# Altium project dory-x.PrjPcb (part 10 of 12)
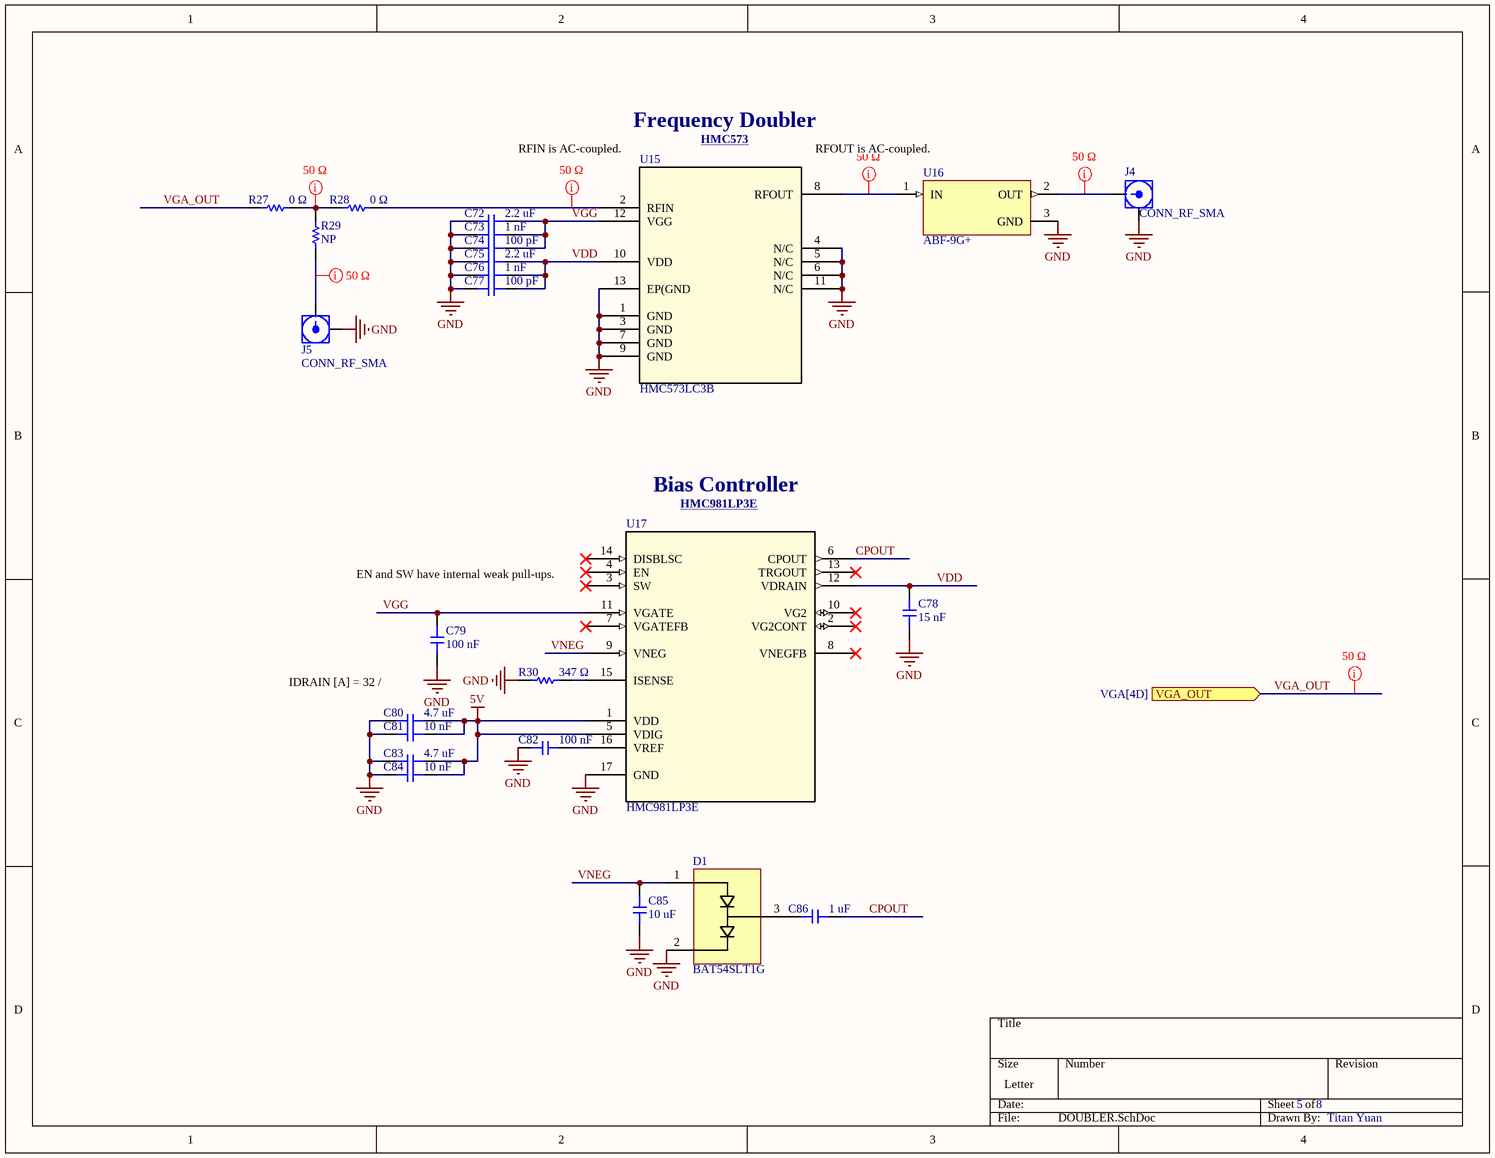
[diagram p16: DOUBLER.SchDoc]

## Sheet DOUBLER.SchDoc: Titan Yuan (continued)

### Library data of the parts (continued)
D1 = BAT54SLT1G: Diode, Schottky Barrier, Fast, Vr 30V, If 200MA, Pkg SOT-23 (TO-236), Config Dual; Manufacturer: onsemi; Manufacturer Lifecycle Status: ACTIVE; Value: 7.6pF; Forward Voltage: 800mV; Max Forward Surge Current (Ifsm): 600mA; Max Junction Temperature (Tj): 150°C; Max Power Dissipation: 225mW; Max Reverse Leakage Current: 2µA; Number of Elements: 2; Peak Non-Repetitive Surge Current: 1A; Recovery Time: 5ns; Reverse Standoff Voltage: 25V; Manufacturer Part Number: BAT54SLT1G; Supplier: DigiKey; Supplier Part Number: BAT54SLT1GOSDKR-ND; RoHS: Compliant; Category: Schottky Diodes; Stock: 2106495; Pricing: 1=0.14, 10=0.087, 100=0.0534, 500=0.03868, 1000=0.03386 (USD); Average Rectified Current: 200mA; Case/Package: SOT-23-3; China RoHS: Compliant; Contact Plating: Tin; Country of Origin: Mainland China; Current Rating: 200mA; Export Control Classification Number (ECCN) Code: EAR99; Element Configuration: Dual; Forward Current: 200mA; Halogen Free: Halogen Free; Height: 1.11mm; Harmonized Tariff Schedule (HTS) Code: 8541.10.00.70; Introduction Date: 1997-10-21; Lead Free: Lead Free; Length: 2.9mm; Lifecycle Status: Production; Max Operating Temperature: 150°C; Max Output current: 200mA; Max Repetitive Reverse Voltage (Vrrm): 30V; Max Reverse Voltage (DC): 30V; Max Surge Current: 600mA; Min Breakdown Voltage: 30V; Min Operating Temperature: -55°C; Pins: 3; Number of Terminals: 3; Packaging: Tape and Reel; Peak Reverse Current: 2µA; Power Dissipation: 225mW; Radiation Hardening: No; REACH SVHC: Yes; Reverse Recovery Time: 5ns; Reverse Voltage: 30V; Schedule B: 8541100070, 8541100070|8541100070|8541100070|8541100070|8541100070; Voltage Rating (DC): 30V; Width: 1.3mm; ComponentLink1URL: https://datasheet.octopart.com:443/BAT54SLT1G-ON-Semiconductor-datasheet-7540227.pdf?src-supplier=Upverter; ComponentLink1Description: https://datasheet.octopart.com:443/BAT54SLT1G-ON-Semiconductor-datasheet-7540227.pdf?src-supplier=Upverter; ComponentLink2URL: https://datasheet.octopart.com:443/BAT54SLT1G-ON-Semiconductor-datasheet-8565751.pdf?src-supplier=Upverter; ComponentLink2Description: https://datasheet.octopart.com:443/BAT54SLT1G-ON-Semiconductor-datasheet-8565751.pdf?src-supplier=Upverter; ComponentLink3URL: https://datasheet.octopart.com:443/BAT54SLT1G-ON-Semiconductor-datasheet-8326751.pdf?src-supplier=Upverter; ComponentLink3Description: https://datasheet.octopart.com:443/BAT54SLT1G-ON-Semiconductor-datasheet-8326751.pdf?src-supplier=Upverter; ComponentLink4URL: https://sigma.octopart.com:443/138897241/technical_drawing/ON-Semiconductor-BAT54SLT1G.pdf?src-supplier=Upverter; ComponentLink4Description: https://sigma.octopart.com:443/138897241/technical_drawing/ON-Semiconductor-BAT54SLT1G.pdf?src-supplier=Upverter; ComponentLink5URL: https://datasheet.octopart.com:443/BAT54SLT1G-ON-Semiconductor-datasheet-94104247.pdf?src-supplier=Newark; ComponentLink5Description: https://datasheet.octopart.com:443/BAT54SLT1G-ON-Semiconductor-datasheet-94104247.pdf?src-supplier=Newark; ComponentLink6URL: https://datasheet.octopart.com:443/BAT54SLT1G-ON-Semiconductor-datasheet-41232696.pdf?src-supplier=Newark; ComponentLink6Description: https://datasheet.octopart.com:443/BAT54SLT1G-ON-Semiconductor-datasheet-41232696.pdf?src-supplier=Newark; ComponentLink7URL: https://datasheet.octopart.com:443/BAT54SLT1G-onsemi-datasheet-175423504.pdf?src-supplier=IHS; ComponentLink7Description: https://datasheet.octopart.com:443/BAT54SLT1G-onsemi-datasheet-175423504.pdf?src-supplier=IHS; ComponentLink8URL: https://datasheet.octopart.com:443/BAT54SLT1G-ON-Semiconductor-datasheet-12519070.pdf?src-supplier=Future+Electronics; ComponentLink8Description: https://datasheet.octopart.com:443/BAT54SLT1G-ON-Semiconductor-datasheet-12519070.pdf?src-supplier=Future+Electronics; ComponentLink9URL: https://datasheet.octopart.com:443/BAT54SLT1G-onsemi-datasheet-189128042.pdf?src-supplier=Master+Electronics; ComponentLink9Description: https://datasheet.octopart.com:443/BAT54SLT1G-onsemi-datasheet-189128042.pdf?src-supplier=Master+Electronics; ComponentLink10URL: https://datasheet.octopart.com:443/BAT54SLT1G-ON-Semiconductor-datasheet-14051817.pdf?src-supplier=iiiC; ComponentLink10Description: https://datasheet.octopart.com:443/BAT54SLT1G-ON-Semiconductor-datasheet-14051817.pdf?src-supplier=iiiC; ComponentLink11URL: https://datasheet.octopart.com:443/BAT54SLT1G-ON-Semiconductor-datasheet-9792373.pdf?src-supplier=RS+(Formerly+Allied+Electronics); ComponentLink11Description: https://datasheet.octopart.com:443/BAT54SLT1G-ON-Semiconductor-datasheet-9792373.pdf?src-supplier=RS+(Formerly+Allied+Electronics); ComponentLink12URL: http://sigma.octopart.com:80/15540786/rohs_certificate/ON-Semiconductor-BAT54SLT1G.pdf?src-supplier=Compliance+Statements; ComponentLink12Description: http://sigma.octopart.com:80/15540786/rohs_certificate/ON-Semiconductor-BAT54SLT1G.pdf?src-supplier=Compliance+Statements; ComponentLink13URL: http://sigma.octopart.com:80/15674221/materials_sheet/ON-Semiconductor-BAT54SLT1G.csv?src-supplier=Compliance+Statements; ComponentLink13Description: http://sigma.octopart.com:80/15674221/materials_sheet/ON-Semiconductor-BAT54SLT1G.csv?src-supplier=Compliance+Statements; ComponentLink14URL: http://sigma.octopart.com:80/150604036/rohs_statement/ON-Semiconductor-BAT54SLT1G.pdf?src-supplier=Compliance+Statements; ComponentLink14Description: http://sigma.octopart.com:80/150604036/rohs_statement/ON-Semiconductor-BAT54SLT1G.pdf?src-supplier=Compliance+Statements; ComponentLink15URL: http://sigma.octopart.com:80/reach_statement/ON-Semiconductor-company-79.pdf?src-supplier=Compliance+Statements; ComponentLink15Description: http://sigma.octopart.com:80/reach_statement/ON-Semiconductor-company-79.pdf?src-supplier=Compliance+Statements; ComponentLink16URL: https://octopart.com:443/opatz8j6/c1?t=u7hVVHNbNMzoRrLG3GojGsnCCzBm0J-uEP0MDN5_QXLmtCuwCttIjTg9FaYGnZ3V6rN612JccPJSF-50DOe7TrljtxuLCnStctklpqwmbwz4tOhLRUiF3xZ0jobsHimKOVbOxssKYz_BsM4DkRw1hTijh2ytuLdfoG4zEHCy44oAEhVV7Q6pU2IDNWkNBWFtnUl98CLdTNu_gYmfqgVI530GC_7RxxXrNyJVhIaAQo1GuraOJrzbdgUthSEhX5U9hoyc9h7OfbfAXpfVU7FwZLzLgSredCa2bHqo2XaXGhEMfxutM31GZjXbs9RUwCclUc4ymMC0Zx_gQP50DF1LLcBCeFO0kNIPzU4&src-supplier=Compliance+Statements; ComponentLink16Description: https://octopart.com:443/opatz8j6/c1?t=u7hVVHNbNMzoRrLG3GojGsnCCzBm0J-uEP0MDN5_QXLmtCuwCttIjTg9FaYGnZ3V6rN612JccPJSF-50DOe7TrljtxuLCnStctklpqwmbwz4tOhLRUiF3xZ0jobsHimKOVbOxssKYz_BsM4DkRw1hTijh2ytuLdfoG4zEHCy44oAEhVV7Q6pU2IDNWkNBWFtnUl98CLdTNu_gYmfqgVI530GC_7RxxXrNyJVhIaAQo1GuraOJrzbdgUthSEhX5U9hoyc9h7OfbfAXpfVU7FwZLzLgSredCa2bHqo2XaXGhEMfxutM31GZjXbs9RUwCclUc4ymMC0Zx_gQP50DF1LLcBCeFO0kNIPzU4&src-supplier=Compliance+Statements; ComponentLink17URL: https://octopart.com:443/opatz8j6/c1?t=Kw7HkJYQLeazeLmya8EA3C6brfyJgOXEJLJTJihYHiH9shpIXLC0ReflMibI60OvVySPV1pjxvw9upklcUxW2wJ1OFPafZaxIj1MIci7olsY5umQMpSkZNdW7s6hfRKt377xlzu2-5Pn9lCPBrlW_bWuV0E2Zi5g_w5nA3f6BsxymWxwr9JD8EDWXN9P4Hbj5ypDZ7H9nSGth4yu0BM_rOK7FaukwZd0eDu6zSq1cOk2X2n5TKmaqej4pn-BTXKw_mdoVJpfBvnDqrwE59SMl2rCvOzVjVRe9TuQQpoWe6MQBndwQuBmwPgNoE1QX3-vOvLyXQCeIHtbLXHLLtv1k6vTooG2ILtHMQ8i&src-supplier=Compliance+Statements; ComponentLink17Description: https://octopart.com:443/opatz8j6/c1?t=Kw7HkJYQLeazeLmya8EA3C6brfyJgOXEJLJTJihYHiH9shpIXLC0ReflMibI60OvVySPV1pjxvw9upklcUxW2wJ1OFPafZaxIj1MIci7olsY5umQMpSkZNdW7s6hfRKt377xlzu2-5Pn9lCPBrlW_bWuV0E2Zi5g_w5nA3f6BsxymWxwr9JD8EDWXN9P4Hbj5ypDZ7H9nSGth4yu0BM_rOK7FaukwZd0eDu6zSq1cOk2X2n5TKmaqej4pn-BTXKw_mdoVJpfBvnDqrwE59SMl2rCvOzVjVRe9TuQQpoWe6MQBndwQuBmwPgNoE1QX3-vOvLyXQCeIHtbLXHLLtv1k6vTooG2ILtHMQ8i&src-supplier=Compliance+Statements
J4 J5 = CONN_RF_SMA: RF / Coaxial Connector, SMA Coaxial, Straight Jack, Solder, 50 ohm, Beryllium Copper; Manufacturer: Cinch Connectivity Solutions Johnson; Maximum Frequency: 18 GHz; Body Material: Brass; Body Plating: Gold; Connector Type: Coaxial, PCB, SMA, Socket; Contact Resistance: 4mΩ; Dielectric Material: PTFE; Frequency: 18GHz; Gender: Female; Impedance: 50Ω; Insulation Resistance: 5GΩ; Number of Contacts: 1; Polarity: Normal; Voltage Rating: 335V; Manufacturer Part Number: 142-0701-801; Supplier: DigiKey; Supplier Part Number: J502-ND; RoHS: Compliant; Category: RF / Coaxial Connectors; Stock: 35108; Pricing: 1=3.73, 10=3.166, 25=2.9676, 50=2.826, 100=2.691, 250=2.52244, 500=2.40206, 1000=2.28748, 2500=2.1444 (USD); Case/Package: SMA; Contact Gender: Female; Contact Material: Gold, Nickel; Contact Plating: Gold; Depth: 25.58mm; Export Control Classification Number (ECCN) Code: EAR99; Fastening Type: Threaded; Height: 9.779mm; Housing Color: Gold; Housing Material: Brass; Harmonized Tariff Schedule (HTS) Code: 8536.69.40.10; Insulation Material: PTFE; Introduction Date: 1994-06-01; Lead Free: Lead Free; Length: 9.52mm; Lifecycle Status: Production; Clock Frequency: 18GHz; Max Operating Temperature: 165°C; Min Operating Temperature: -65°C; Mounting Technology: Edge, PCB; Pins: 1; Number of Ports: 1; Orientation: Straight; Radiation Hardening: No; REACH SVHC: No; Schedule B: 8536695050, 8536695050|8536695050|8536695050|8536695050|8536695050; Shell Material: Brass; Termination: Solder; ComponentLink1URL: https://datasheet.octopart.com:443/142-0701-801-Cinch-Connectors-datasheet-38159423.pdf?src-supplier=element14+APAC; ComponentLink1Description: https://datasheet.octopart.com:443/142-0701-801-Cinch-Connectors-datasheet-38159423.pdf?src-supplier=element14+APAC; ComponentLink2URL: https://datasheet.octopart.com:443/142-0701-801-Cinch-Connectivity-Solutions-datasheet-128878268.pdf?src-supplier=JRH+Electronics; ComponentLink2Description: https://datasheet.octopart.com:443/142-0701-801-Cinch-Connectivity-Solutions-datasheet-128878268.pdf?src-supplier=JRH+Electronics; ComponentLink3URL: https://datasheet.octopart.com:443/142-0701-801-Cinch-Connectivity-Solutions-datasheet-180501451.pdf?src-supplier=IHS; ComponentLink3Description: https://datasheet.octopart.com:443/142-0701-801-Cinch-Connectivity-Solutions-datasheet-180501451.pdf?src-supplier=IHS; ComponentLink4URL: https://datasheet.octopart.com:443/142-0701-801-Cinch-Connectivity-Solutions-datasheet-182240672.pdf?src-supplier=IHS; ComponentLink4Description: https://datasheet.octopart.com:443/142-0701-801-Cinch-Connectivity-Solutions-datasheet-182240672.pdf?src-supplier=IHS; ComponentLink5URL: https://datasheet.octopart.com:443/142-0701-801-Emerson-datasheet-182246267.pdf?src-supplier=IHS; ComponentLink5Description: https://datasheet.octopart.com:443/142-0701-801-Emerson-datasheet-182246267.pdf?src-supplier=IHS; ComponentLink6URL: https://datasheet.octopart.com:443/142-0701-801-Emerson-Network-Power-datasheet-40124.pdf?src-supplier=Newark; ComponentLink6Description: https://datasheet.octopart.com:443/142-0701-801-Emerson-Network-Power-datasheet-40124.pdf?src-supplier=Newark; ComponentLink7URL: https://datasheet.octopart.com:443/142-0701-801-Cinch-Connectors-datasheet-24914353.pdf?src-supplier=Electro+Sonic; ComponentLink7Description: https://datasheet.octopart.com:443/142-0701-801-Cinch-Connectors-datasheet-24914353.pdf?src-supplier=Electro+Sonic; ComponentLink8URL: https://datasheet.octopart.com:443/142-0701-801-Emerson-Network-Power-datasheet-14433785.pdf?src-supplier=Farnell; ComponentLink8Description: https://datasheet.octopart.com:443/142-0701-801-Emerson-Network-Power-datasheet-14433785.pdf?src-supplier=Farnell; ComponentLink9URL: https://datasheet.octopart.com:443/142-0701-801-Emerson-Network-Power-datasheet-8828422.pdf?src-supplier=Farnell; ComponentLink9Description: https://datasheet.octopart.com:443/142-0701-801-Emerson-Network-Power-datasheet-8828422.pdf?src-supplier=Farnell; ComponentLink10URL: https://datasheet.octopart.com:443/142-0701-801-Emerson-Network-Power-datasheet-10031126.pdf?src-supplier=Farnell; ComponentLink10Description: https://datasheet.octopart.com:443/142-0701-801-Emerson-Network-Power-datasheet-10031126.pdf?src-supplier=Farnell; ComponentLink11URL: https://datasheet.octopart.com:443/142-0701-801-Emerson-Network-Power-datasheet-47159.pdf?src-supplier=Farnell; ComponentLink11Description: https://datasheet.octopart.com:443/142-0701-801-Emerson-Network-Power-datasheet-47159.pdf?src-supplier=Farnell; ComponentLink12URL: https://datasheet.octopart.com:443/142-0701-801-Emerson-Network-Power-datasheet-29036.pdf?src-supplier=Farnell; ComponentLink12Description: https://datasheet.octopart.com:443/142-0701-801-Emerson-Network-Power-datasheet-29036.pdf?src-supplier=Farnell; ComponentLink13URL: https://datasheet.octopart.com:443/142-0701-801-Semflex-datasheet-33021794.pdf?src-supplier=East+Coast+Microwave; ComponentLink13Description: https://datasheet.octopart.com:443/142-0701-801-Semflex-datasheet-33021794.pdf?src-supplier=East+Coast+Microwave; ComponentLink14URL: https://datasheet.octopart.com:443/142-0701-801-Emerson-datasheet-31818286.pdf?src-supplier=East+Coast+Microwave; ComponentLink14Description: https://datasheet.octopart.com:443/142-0701-801-Emerson-datasheet-31818286.pdf?src-supplier=East+Coast+Microwave; ComponentLink15URL: https://datasheet.octopart.com:443/142-0701-801-Cinch-Connectors-datasheet-27682.pdf?src-supplier=RS+(Formerly+Allied+Electronics); ComponentLink15Description: https://datasheet.octopart.com:443/142-0701-801-Cinch-Connectors-datasheet-27682.pdf?src-supplier=RS+(Formerly+Allied+Electronics); ComponentLink16URL: https://datasheet.octopart.com:443/142-0701-801-Emerson-Network-Power-datasheet-644257.pdf?src-supplier=Future+Electronics; ComponentLink16Description: https://datasheet.octopart.com:443/142-0701-801-Emerson-Network-Power-datasheet-644257.pdf?src-supplier=Future+Electronics; ComponentLink17URL: https://datasheet.octopart.com:443/142-0701-801-Emerson-Network-Power-datasheet-55164.pdf?src-supplier=_legacy+Avnet; ComponentLink17Description: https://datasheet.octopart.com:443/142-0701-801-Emerson-Network-Power-datasheet-55164.pdf?src-supplier=_legacy+Avnet
R27 R28 = RES: GENERAL PURPOSE CHIP RESISTOR Metal Glaze/thick Film, 0.0625W, 0ohm, Surface Mount, 0402; Manufacturer: Yageo; Manufacturer Part Number: RC0402FR-070RL; Power Rating: 1/16 W; Power Dissipation: 62.5mW; Value: 0Ω; Voltage Rating: 50V; Tolerance: *; Package Size: 0402; Supplier: DigiKey; Supplier Part Number: 311-0.0LRCT-ND; RoHS: Compliant; Category: Chip SMD Resistors; Stock: 6847013; Pricing: 1=0.1, 10=0.010, 25=0.0064, 50=0.0054, 100=0.0047, 250=0.00392, 500=0.00346, 1000=0.00304, 5000=0.0023 (USD); Case/Package: 0402; Case Code (Imperial): 0402; Case Code (Metric): 1005; China RoHS: Non-Compliant; Composition: Thick Film; Contact Plating: Tin; Country of Origin: Mainland China, Taiwan; Export Control Classification Number (ECCN) Code: EAR99; Height: 350µm; Harmonized Tariff Schedule (HTS) Code: 8533.21.00.30; Introduction Date: 2004-09-22; Lead Free: Lead Free; Length: 1mm; Lifecycle Status: Production; Max Operating Temperature: 155°C; Min Operating Temperature: -55°C; Mounting Technology: Surface Mount; Number of Terminals: 2; Packaging: Tape & Reel; Radiation Hardening: No; REACH SVHC: Yes; Termination: SMD/SMT; Width: 500µm; ComponentLink1URL: https://datasheet.octopart.com:443/RC0402FR-070RL-Yageo-datasheet-141265859.pdf?src-supplier=Upverter; ComponentLink1Description: https://datasheet.octopart.com:443/RC0402FR-070RL-Yageo-datasheet-141265859.pdf?src-supplier=Upverter; ComponentLink2URL: https://sigma.octopart.com:443/138820526/technical_drawing/Yageo-RC0402FR-070RL.pdf?src-supplier=Upverter; ComponentLink2Description: https://sigma.octopart.com:443/138820526/technical_drawing/Yageo-RC0402FR-070RL.pdf?src-supplier=Upverter; ComponentLink3URL: https://datasheet.octopart.com:443/RC0402FR-070RL-Yageo-datasheet-12531192.pdf?src-supplier=IHS; ComponentLink3Description: https://datasheet.octopart.com:443/RC0402FR-070RL-Yageo-datasheet-12531192.pdf?src-supplier=IHS; ComponentLink4URL: https://datasheet.octopart.com:443/RC0402FR-070RL-Yageo-Group-datasheet-176638170.pdf?src-supplier=Future+Electronics; ComponentLink4Description: https://datasheet.octopart.com:443/RC0402FR-070RL-Yageo-Group-datasheet-176638170.pdf?src-supplier=Future+Electronics; ComponentLink5URL: https://datasheet.octopart.com:443/RC0402FR-070RL-Yageo-datasheet-164759695.pdf?src-supplier=Future+Electronics; ComponentLink5Description: https://datasheet.octopart.com:443/RC0402FR-070RL-Yageo-datasheet-164759695.pdf?src-supplier=Future+Electronics; ComponentLink6URL: https://datasheet.octopart.com:443/RC0402FR-070RL-Yageo-datasheet-137700087.pdf?src-supplier=Future+Electronics; ComponentLink6Description: https://datasheet.octopart.com:443/RC0402FR-070RL-Yageo-datasheet-137700087.pdf?src-supplier=Future+Electronics; ComponentLink7URL: https://datasheet.octopart.com:443/RC0402FR-070RL-Yageo-datasheet-10408619.pdf?src-supplier=Future+Electronics; ComponentLink7Description: https://datasheet.octopart.com:443/RC0402FR-070RL-Yageo-datasheet-10408619.pdf?src-supplier=Future+Electronics; ComponentLink8URL: https://datasheet.octopart.com:443/RC0402FR-070RL-Yageo-datasheet-8324527.pdf?src-supplier=Future+Electronics; ComponentLink8Description: https://datasheet.octopart.com:443/RC0402FR-070RL-Yageo-datasheet-8324527.pdf?src-supplier=Future+Electronics; ComponentLink9URL: https://datasheet.octopart.com:443/RC0402FR-070RL-Yageo-datasheet-79472498.pdf?src-supplier=Megastar; ComponentLink9Description: https://datasheet.octopart.com:443/RC0402FR-070RL-Yageo-datasheet-79472498.pdf?src-supplier=Megastar; ComponentLink10URL: https://datasheet.octopart.com/RC0402FR-070RL-Yageo-datasheet-73766026.pdf; ComponentLink10Description: https://datasheet.octopart.com/RC0402FR-070RL-Yageo-datasheet-73766026.pdf; ComponentLink11URL: http://sigma.octopart.com:80/conflict_mineral_statement/Yageo-company-3.pdf?src-supplier=Compliance+Statements; ComponentLink11Description: http://sigma.octopart.com:80/conflict_mineral_statement/Yageo-company-3.pdf?src-supplier=Compliance+Statements; ComponentLink12URL: http://sigma.octopart.com:80/rohs_statement/Yageo-company-2.pdf?src-supplier=Compliance+Statements; ComponentLink12Description: http://sigma.octopart.com:80/rohs_statement/Yageo-company-2.pdf?src-supplier=Compliance+Statements
R29 = RES: Resistor SMD Generic; Manufacturer: *; Manufacturer Part Number: *; Tolerance: *; Power Rating: *; Package Size: 0402
R30 = RES: 100mW Thick Film Resistors 75V ±100ppm/℃ ±1% 348Ω 0603 Chip Resistor - Surface Mount ROHS; Manufacturer: Yageo; Manufacturer Part Number: RC0603FR-07348RL; Tolerance: +-1%; Power Rating: 1/10 W; Temperature Coefficient: 100ppm/°C; Voltage Rating (DC): 50V; Package Size: 0603; Supplier: DigiKey; Supplier Part Number: 311-348HRCT-ND; RoHS: Compliant; Category: Chip SMD Resistors; Stock: 429715; Pricing: 1=0.1, 10=0.009, 25=0.0076, 50=0.0062, 100=0.0057 (USD); Case/Package: 0603; Case Code (Metric): 0603; China RoHS: Non-Compliant; Composition: Thick Film; Contact Plating: Tin; Country of Origin: Mainland China, Taiwan; Export Control Classification Number (ECCN) Code: EAR99; Height: 450µm; Harmonized Tariff Schedule (HTS) Code: 8533.21.00.30; Introduction Date: 2004-09-22; Lead Free: Lead Free; Length: 1.6mm; Lifecycle Status: Production; Max Operating Temperature: 155°C; Min Operating Temperature: -55°C; Mounting Technology: Surface Mount; Number of Terminals: 2; Packaging: Tape & Reel; Power Dissipation: 100mW; Radiation Hardening: No; REACH SVHC: Yes; Value: 348Ω; Schedule B: 8533210045, 8533210045|8533210045|8533210045|8533210045|8533210045; Voltage Rating: 75V; Width: 800µm; Working Voltage: 75V; ComponentLink1URL: https://datasheet.octopart.com:443/RC0603FR-07348RL-Yageo-datasheet-175887523.pdf?src-supplier=Newark; ComponentLink1Description: https://datasheet.octopart.com:443/RC0603FR-07348RL-Yageo-datasheet-175887523.pdf?src-supplier=Newark; ComponentLink2URL: https://datasheet.octopart.com:443/RC0603FR-07348RL-Yageo-datasheet-103092701.pdf?src-supplier=Upverter; ComponentLink2Description: https://datasheet.octopart.com:443/RC0603FR-07348RL-Yageo-datasheet-103092701.pdf?src-supplier=Upverter; ComponentLink3URL: https://datasheet.octopart.com:443/RC0603FR-07348RL-Yageo-Group-datasheet-176638170.pdf?src-supplier=Future+Electronics; ComponentLink3Description: https://datasheet.octopart.com:443/RC0603FR-07348RL-Yageo-Group-datasheet-176638170.pdf?src-supplier=Future+Electronics; ComponentLink4URL: https://datasheet.octopart.com:443/RC0603FR-07348RL-Yageo-datasheet-164759695.pdf?src-supplier=Future+Electronics; ComponentLink4Description: https://datasheet.octopart.com:443/RC0603FR-07348RL-Yageo-datasheet-164759695.pdf?src-supplier=Future+Electronics; ComponentLink5URL: https://datasheet.octopart.com:443/RC0603FR-07348RL-Yageo-datasheet-137700087.pdf?src-supplier=Future+Electronics; ComponentLink5Description: https://datasheet.octopart.com:443/RC0603FR-07348RL-Yageo-datasheet-137700087.pdf?src-supplier=Future+Electronics; ComponentLink6URL: https://datasheet.octopart.com:443/RC0603FR-07348RL-Yageo-datasheet-15599030.pdf?src-supplier=Future+Electronics; ComponentLink6Description: https://datasheet.octopart.com:443/RC0603FR-07348RL-Yageo-datasheet-15599030.pdf?src-supplier=Future+Electronics; ComponentLink7URL: https://datasheet.octopart.com:443/RC0603FR-07348RL-Yageo-datasheet-12596169.pdf?src-supplier=Future+Electronics; ComponentLink7Description: https://datasheet.octopart.com:443/RC0603FR-07348RL-Yageo-datasheet-12596169.pdf?src-supplier=Future+Electronics; ComponentLink8URL: https://datasheet.octopart.com:443/RC0603FR-07348RL-Yageo-datasheet-8328172.pdf?src-supplier=Future+Electronics; ComponentLink8Description: https://datasheet.octopart.com:443/RC0603FR-07348RL-Yageo-datasheet-8328172.pdf?src-supplier=Future+Electronics; ComponentLink9URL: https://datasheet.octopart.com/RC0603FR-07348RL-Yageo-datasheet-73766026.pdf; ComponentLink9Description: https://datasheet.octopart.com/RC0603FR-07348RL-Yageo-datasheet-73766026.pdf; ComponentLink10URL: https://datasheet.octopart.com:443/RC0603FR-07348RL-Yageo-datasheet-118562.pdf?src-supplier=DigiKey; ComponentLink10Description: https://datasheet.octopart.com:443/RC0603FR-07348RL-Yageo-datasheet-118562.pdf?src-supplier=DigiKey; ComponentLink11URL: http://sigma.octopart.com:80/conflict_mineral_statement/Yageo-company-3.pdf?src-supplier=Compliance+Statements; ComponentLink11Description: http://sigma.octopart.com:80/conflict_mineral_statement/Yageo-company-3.pdf?src-supplier=Compliance+Statements; ComponentLink12URL: http://sigma.octopart.com:80/rohs_statement/Yageo-company-2.pdf?src-supplier=Compliance+Statements; ComponentLink12Description: http://sigma.octopart.com:80/rohs_statement/Yageo-company-2.pdf?src-supplier=Compliance+Statements
U15 = HMC573LC3B: IC Multiplier X2 Bb 12SMD "rf IC Frequency Multiplier Dbs, Vsat 8GHZ ~ 22GHZ 12-SMT (3X3)"; Manufacturer_Name: Analog Devices Inc; Manufacturer: Analog Devices; Manufacturer Part Number: HMC573LC3BTR; Manufacturer Lifecycle Status: PRODUCTION; Max Power Dissipation: 719mW; Max Supply Voltage: 5.5V; Min Supply Voltage: 4.5V; Number of Channels: 1; Operating Supply Current: 92mA; Operating Supply Voltage: 5V; Copyright: Copyright (C) 2026 Ultra Librarian. All rights reserved.; Manufacturer_Part_Number: HMC573LC3B; Datasheet: https://www.analog.com/media/en/technical-documentation/data-sheets/hmc573.pdf; RefDes: RefDes; Type: Type; Supplier: DigiKey; Supplier Part Number: 1127-1772-1-ND; RoHS: Compliant; Category: NFC / RFID Components; Stock: 200; Pricing: 1=81.63, 10=67.969, 25=66.402 (USD); Case/Package: SMD/SMT; Contact Plating: Gold; Frequency: 22GHz; Height: 920µm; Lifecycle Status: Production; Clock Frequency: 22GHz; Max Operating Temperature: 85°C; Min Operating Temperature: -40°C; Mounting Technology: Surface Mount; Pins: 12; Schedule B: 8542390000, 8542390000|8542390000, 8542390000|8542390000|8542390000, 8542390000|8542390000|8542390000|8542390000; ComponentLink1URL: https://octopart.com:443/opatz8j6/c1?t=DcV52FniVEofaIIKJFF0W7QczyDTImT9hpD5-BlosD5haEDCy5MH2QQyu-lZIN0IPtzzIoEuQnOz02v3MoqfEkgkuRI5b55uGYn3kBRuSBp_GFOeZPK3IqjlLJc-bzdQbkIyYaKLGWGS-4gUL_23mxKydGpMZ_sxepxSn39nazc050O5bnoa0ejSYa9e2o-TZnn-fDiz6hYujwMY-orHgrZdNlmZ37LfFt9M3X4vtAGxIRZYLCpXcmTt9OBrR8WzeHsirkMrgsE8J-KMwy_8lrzOvNmETFVSAcF6tmRq8V0nKn0-dUG9PQ&src-supplier=Analog+Devices; ComponentLink1Description: https://octopart.com:443/opatz8j6/c1?t=DcV52FniVEofaIIKJFF0W7QczyDTImT9hpD5-BlosD5haEDCy5MH2QQyu-lZIN0IPtzzIoEuQnOz02v3MoqfEkgkuRI5b55uGYn3kBRuSBp_GFOeZPK3IqjlLJc-bzdQbkIyYaKLGWGS-4gUL_23mxKydGpMZ_sxepxSn39nazc050O5bnoa0ejSYa9e2o-TZnn-fDiz6hYujwMY-orHgrZdNlmZ37LfFt9M3X4vtAGxIRZYLCpXcmTt9OBrR8WzeHsirkMrgsE8J-KMwy_8lrzOvNmETFVSAcF6tmRq8V0nKn0-dUG9PQ&src-supplier=Analog+Devices; ComponentLink2URL: https://datasheet.octopart.com:443/HMC573LC3BTR-Analog-Devices-datasheet-36992451.pdf?src-supplier=Analog+Devices; ComponentLink2Description: https://datasheet.octopart.com:443/HMC573LC3BTR-Analog-Devices-datasheet-36992451.pdf?src-supplier=Analog+Devices; ComponentLink3URL: https://datasheet.octopart.com:443/HMC573LC3BTR-Analog-Devices-datasheet-78834209.pdf?src-supplier=Newark; ComponentLink3Description: https://datasheet.octopart.com:443/HMC573LC3BTR-Analog-Devices-datasheet-78834209.pdf?src-supplier=Newark; ComponentLink4URL: https://sigma.octopart.com:443/155366610/technical_drawing/Analog-Devices-HMC573LC3BTR.pdf?src-supplier=Upverter; ComponentLink4Description: https://sigma.octopart.com:443/155366610/technical_drawing/Analog-Devices-HMC573LC3BTR.pdf?src-supplier=Upverter; ComponentLink5URL: https://datasheet.octopart.com:443/HMC573LC3BTR-Analog-Devices-datasheet-80866142.pdf?src-supplier=Farnell; ComponentLink5Description: https://datasheet.octopart.com:443/HMC573LC3BTR-Analog-Devices-datasheet-80866142.pdf?src-supplier=Farnell; ComponentLink6URL: http://sigma.octopart.com:80/conflict_mineral_statement/Analog-Devices-company-33.pdf?src-supplier=Compliance+Statements; ComponentLink6Description: http://sigma.octopart.com:80/conflict_mineral_statement/Analog-Devices-company-33.pdf?src-supplier=Compliance+Statements; ComponentLink7URL: https://octopart.com:443/opatz8j6/c1?t=P8BW34FIkNJpy8Mjwu96XNc8q4Zn1AHntM5gSeHsAXBr-0TaEmsFdSMKPLHni9k5k5AjdoUJOhgJi4QEOpy1dWJeYuxGXSVYBePCvwW8QKtgWhf0SJ2tKKd6NF6MbqmQo0Jm68CtqLfpoGyOnbIjQtXDWwCYbMXlNr8Eu_c9YNNcqIovu-wOlFm74J1-7_oGBcex7ubuaTan3XJT1_LWvxhilUo8wO-qDEaxXwlB-YrWMNUEPHzwCMGgGf5ZbMwjUlHosYoQo9qHqygG-XuGx9IHemcfvVYxGjfT_opnh_P-w5Ogi3vlpQ&src-supplier=Compliance+Statements; ComponentLink7Description: https://octopart.com:443/opatz8j6/c1?t=P8BW34FIkNJpy8Mjwu96XNc8q4Zn1AHntM5gSeHsAXBr-0TaEmsFdSMKPLHni9k5k5AjdoUJOhgJi4QEOpy1dWJeYuxGXSVYBePCvwW8QKtgWhf0SJ2tKKd6NF6MbqmQo0Jm68CtqLfpoGyOnbIjQtXDWwCYbMXlNr8Eu_c9YNNcqIovu-wOlFm74J1-7_oGBcex7ubuaTan3XJT1_LWvxhilUo8wO-qDEaxXwlB-YrWMNUEPHzwCMGgGf5ZbMwjUlHosYoQo9qHqygG-XuGx9IHemcfvVYxGjfT_opnh_P-w5Ogi3vlpQ&src-supplier=Compliance+Statements
U16 = ABF-9G+: 9GHz Center Frequency Band Pass RF Filter (Radio Frequency) 1.6GHz Bandwidth 2.5dB 6-SMD, No Lead; Manufacturer: Mini-Circuits; Manufacturer Part Number: ABF-9G+
U17 = HMC981LP3E: HMC981 Strip Surface Mount Current Biasing pmic power management device 3mm 8V -55C~85C 7.5mA; Manufacturer_Name: Analog Devices Inc; Manufacturer: Analog Devices; Manufacturer Lifecycle Status: PRODUCTION; Clock Frequency: 300kHz; Max Junction Temperature (Tj): 125°C; Max Supply Voltage: 12V; Min Supply Voltage: 4V; Copyright: Copyright (C) 2026 Ultra Librarian. All rights reserved.; Manufacturer_Part_Number: HMC981LP3E; Datasheet: https://www.analog.com/media/en/technical-documentation/data-sheets/hmc981.pdf; RefDes: RefDes; Type: Type; Supplier: DigiKey; Supplier Part Number: 505-HMC981LP3E-ND; Manufacturer Part Number: HMC981LP3E; RoHS: Compliant; Category: RF Amplifiers; Stock: 1863; Pricing: 1=47.19, 10=38.672, 25=36.5452, 100=34.2081, 250=33.09428 (USD); Case/Package: SMD/SMT; Height: 900µm; Lead Free: Contains Lead; Lifecycle Status: Production; Max Operating Temperature: 85°C; Min Operating Temperature: -40°C; Mounting Technology: Surface Mount; Pins: 16; Operating Supply Current: 7.5mA; REACH SVHC: No; Schedule B: 8542390000, 8542390000|8542390000|8542390000|8542390000|8542390000|8542390000|8542390000|8542390000|8542390000|8542390000|8542390000|8542390000|8542390000|8542390000|8542390000|8542390000|8542390000|8542390000|8542390000|8542390000|8542390000|8542390000|8542390000|85; ComponentLink1URL: https://datasheet.octopart.com:443/HMC981LP3E-Analog-Devices-datasheet-86814162.pdf?src-supplier=Augswan; ComponentLink1Description: https://datasheet.octopart.com:443/HMC981LP3E-Analog-Devices-datasheet-86814162.pdf?src-supplier=Augswan; ComponentLink2URL: https://octopart.com:443/opatz8j6/c1?t=0I3Fn8yf5RmPoVF0-wFeETJBBPQJTySQNY7YeBXKGjkQvmY1TQkEj_LUe9bil36HCaq3EuZ5QzCRXfyK5_z4qGJIRpNowls4FZ2HfaBvxefM70Ue1ghpfx78J-oygIcHbvA6bupRGTLqMsV0NfbcBQ6Y00_4XlJh-9tT8MsC7x-bE5WuteqvkuZ9xVwJHqDzlDSctwy8mW6rIkiAChDr86jOE5EYdaeJt7JMC1ZT9P3feVk_Ig4sWBEgp2qZr6B1RBczfaz-wR-9RW3NVq1x9J43UAe9C5r8aal7djcZmVkO6USH0aE3JEGrfoI&src-supplier=Analog+Devices; ComponentLink2Description: https://octopart.com:443/opatz8j6/c1?t=0I3Fn8yf5RmPoVF0-wFeETJBBPQJTySQNY7YeBXKGjkQvmY1TQkEj_LUe9bil36HCaq3EuZ5QzCRXfyK5_z4qGJIRpNowls4FZ2HfaBvxefM70Ue1ghpfx78J-oygIcHbvA6bupRGTLqMsV0NfbcBQ6Y00_4XlJh-9tT8MsC7x-bE5WuteqvkuZ9xVwJHqDzlDSctwy8mW6rIkiAChDr86jOE5EYdaeJt7JMC1ZT9P3feVk_Ig4sWBEgp2qZr6B1RBczfaz-wR-9RW3NVq1x9J43UAe9C5r8aal7djcZmVkO6USH0aE3JEGrfoI&src-supplier=Analog+Devices; ComponentLink3URL: https://sigma.octopart.com:443/138799923/technical_drawing/Analog-Devices-HMC981LP3E.pdf?src-supplier=Upverter; ComponentLink3Description: https://sigma.octopart.com:443/138799923/technical_drawing/Analog-Devices-HMC981LP3E.pdf?src-supplier=Upverter; ComponentLink4URL: https://datasheet.octopart.com:443/HMC981LP3E-Analog-Devices-datasheet-36992499.pdf?src-supplier=Farnell; ComponentLink4Description: https://datasheet.octopart.com:443/HMC981LP3E-Analog-Devices-datasheet-36992499.pdf?src-supplier=Farnell; ComponentLink5URL: http://sigma.octopart.com:80/conflict_mineral_statement/Analog-Devices-company-33.pdf?src-supplier=Compliance+Statements; ComponentLink5Description: http://sigma.octopart.com:80/conflict_mineral_statement/Analog-Devices-company-33.pdf?src-supplier=Compliance+Statements; ComponentLink6URL: https://octopart.com:443/opatz8j6/c1?t=vMFW1dBWkTcoPH1JqwMX9qO8oYTGopj2SzlikHXqF2hnUjTgOSrNOFKPTvzkUwhIetoSYfAZDtSH55eX6ma5rZWKTU8Jj6B04xrxI4AFpjA4h0LG9iFBviy8FQFOv-J5cG-bgNBK8GinwCtxm0laf6j2HB2V5XvH_kSRuCXre5_Cdgp47roLZdePea7Nu0eGU5Bak001VHQhZpSze2GM3jAwo8qGAl7BLk4js4SwFVQxOzEIgalXMe3NxZe5bHgSvU9vCRe9_YuS965reUEP5-udpV11l7NH9pT9RMBHiQUVcKOEKGAc_p7IJDU&src-supplier=Compliance+Statements; ComponentLink6Description: https://octopart.com:443/opatz8j6/c1?t=vMFW1dBWkTcoPH1JqwMX9qO8oYTGopj2SzlikHXqF2hnUjTgOSrNOFKPTvzkUwhIetoSYfAZDtSH55eX6ma5rZWKTU8Jj6B04xrxI4AFpjA4h0LG9iFBviy8FQFOv-J5cG-bgNBK8GinwCtxm0laf6j2HB2V5XvH_kSRuCXre5_Cdgp47roLZdePea7Nu0eGU5Bak001VHQhZpSze2GM3jAwo8qGAl7BLk4js4SwFVQxOzEIgalXMe3NxZe5bHgSvU9vCRe9_YuS965reUEP5-udpV11l7NH9pT9RMBHiQUVcKOEKGAc_p7IJDU&src-supplier=Compliance+Statements

## Sheet POWER.SchDoc
size Letter; DrawnBy: Titan Yuan; SheetNumber: 6; SheetTotal: 8
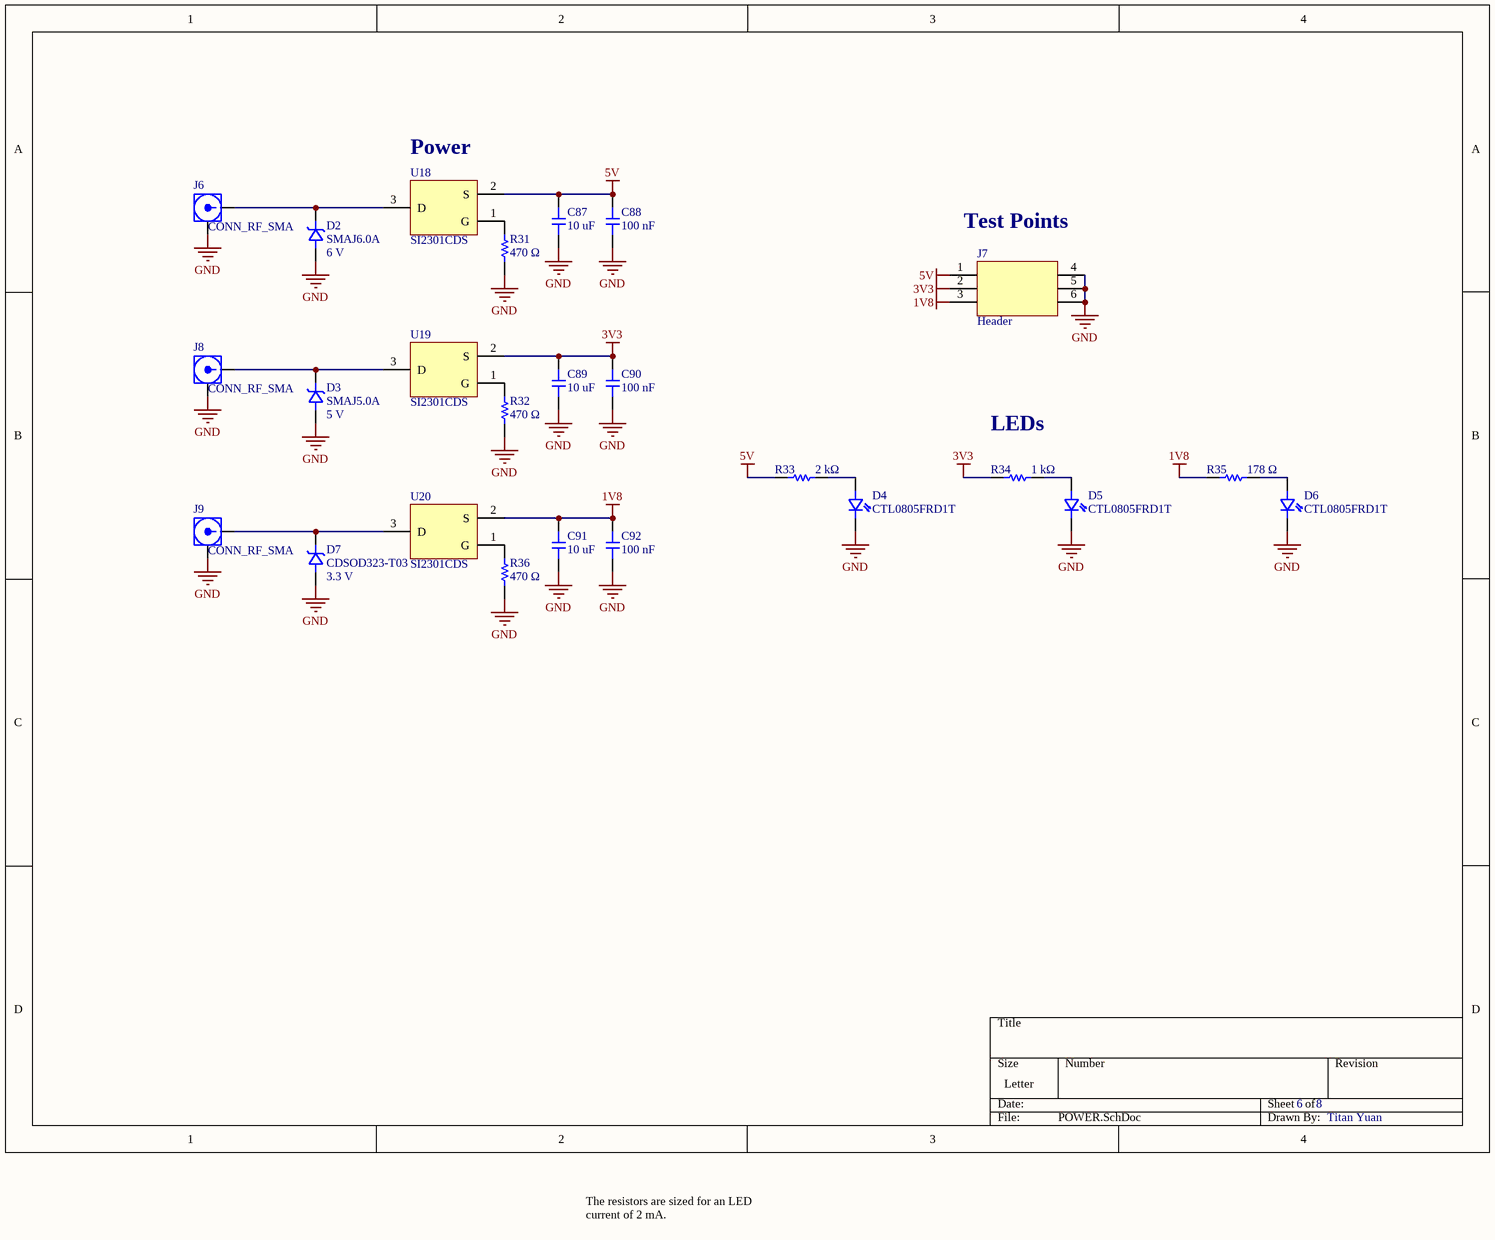
[diagram p5: POWER.SchDoc]

### Parts
C87  10 uF  [CAP_0603]
C88  100 nF  [CAP_0402]
C89  10 uF  [CAP_0603]
C90  100 nF  [CAP_0402]
C91  10 uF  [CAP_0603]
C92  100 nF  [CAP_0402]
D2  SMAJ6.0A  Reverse Standoff Voltage: 6 V  [SMAJ]
D3  SMAJ5.0A  Reverse Standoff Voltage: 5 V  [SMAJ]
D4  CTL0805FRD1T  [CTL0805FRD1T]
D5  CTL0805FRD1T  [CTL0805FRD1T]
D6  CTL0805FRD1T  [CTL0805FRD1T]
D7  CDSOD323-T03  Reverse Standoff Voltage: 3.3 V  [CDSOD323]
J6  CONN_RF_SMA  [142-0701-801]
J7  Header  [CONN_2x3_2.54mm_PinHeader_Vertical]
J8  CONN_RF_SMA  [142-0701-801]
J9  CONN_RF_SMA  [142-0701-801]
R31  470 Ω  [RES_0402]
R32  470 Ω  [RES_0402]
R33  2 kΩ  [RES_0603]
R34  1 kΩ  [RES_0603]
R35  178 Ω  [RES_0603]
R36  470 Ω  [RES_0402]
U18  SI2301CDS  [SI2301CDS]
U19  SI2301CDS  [SI2301CDS]
U20  SI2301CDS  [SI2301CDS]

### Nets
1V8: C91.2 C92.2 J7.3 R35.1 U20.2(S)
3V3: C89.2 C90.2 J7.2 R34.1 U19.2(S)
5V: C87.2 C88.2 J7.1 R33.1 U18.2(S)
GND: C87.1 C88.1 C89.1 C90.1 C91.1 C92.1 D2.2 D3.2 D4.1 D5.1 D6.1 D7.2 J6.2 J7.4 J7.5 J7.6 J8.2 J9.2 R31.1 R32.1 R36.1
NetD2_1: D2.1 J6.1 U18.3(D)
NetD3_1: D3.1 J8.1 U19.3(D)
NetD4_2: D4.2 R33.2
NetD5_2: D5.2 R34.2
NetD6_2: D6.2 R35.2
NetD7_1: D7.1 J9.1 U20.3(D)
NetR31_2: R31.2 U18.1(G)
NetR32_2: R32.2 U19.1(G)
NetR36_2: R36.2 U20.1(G)

### Notes on the sheet
- (near U18) Power
- (near J7) Test Points
- (near R34) LEDs
- The resistors are sized for an LED current of 2 mA.